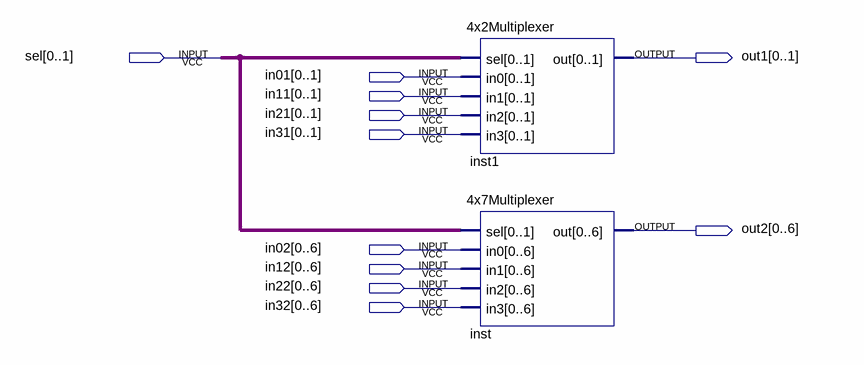
[diagram p0: schematic sheet]
// Quartus schematic 6x2Multiplexer.bdf as structural Verilog: 2 symbols, 11 pins
module \6x2Multiplexer  (
  input  [0:1] sel,
  input  [0:1] in01,
  input  [0:1] in11,
  input  [0:1] in21,
  input  [0:1] in31,
  input  [0:6] in02,
  input  [0:6] in12,
  input  [0:6] in22,
  input  [0:6] in32,
  output [0:1] out1,
  output [0:6] out2
);

  \4x2Multiplexer  inst1 (.sel(sel), .in0(in01), .in1(in11), .in2(in21), .in3(in31), .out(out1));
  \4x7Multiplexer  inst (.sel(sel), .in0(in02), .in1(in12), .in2(in22), .in3(in32), .out(out2));
endmodule
